# Altium schematic sheet Sheet1.SchDoc
size A4
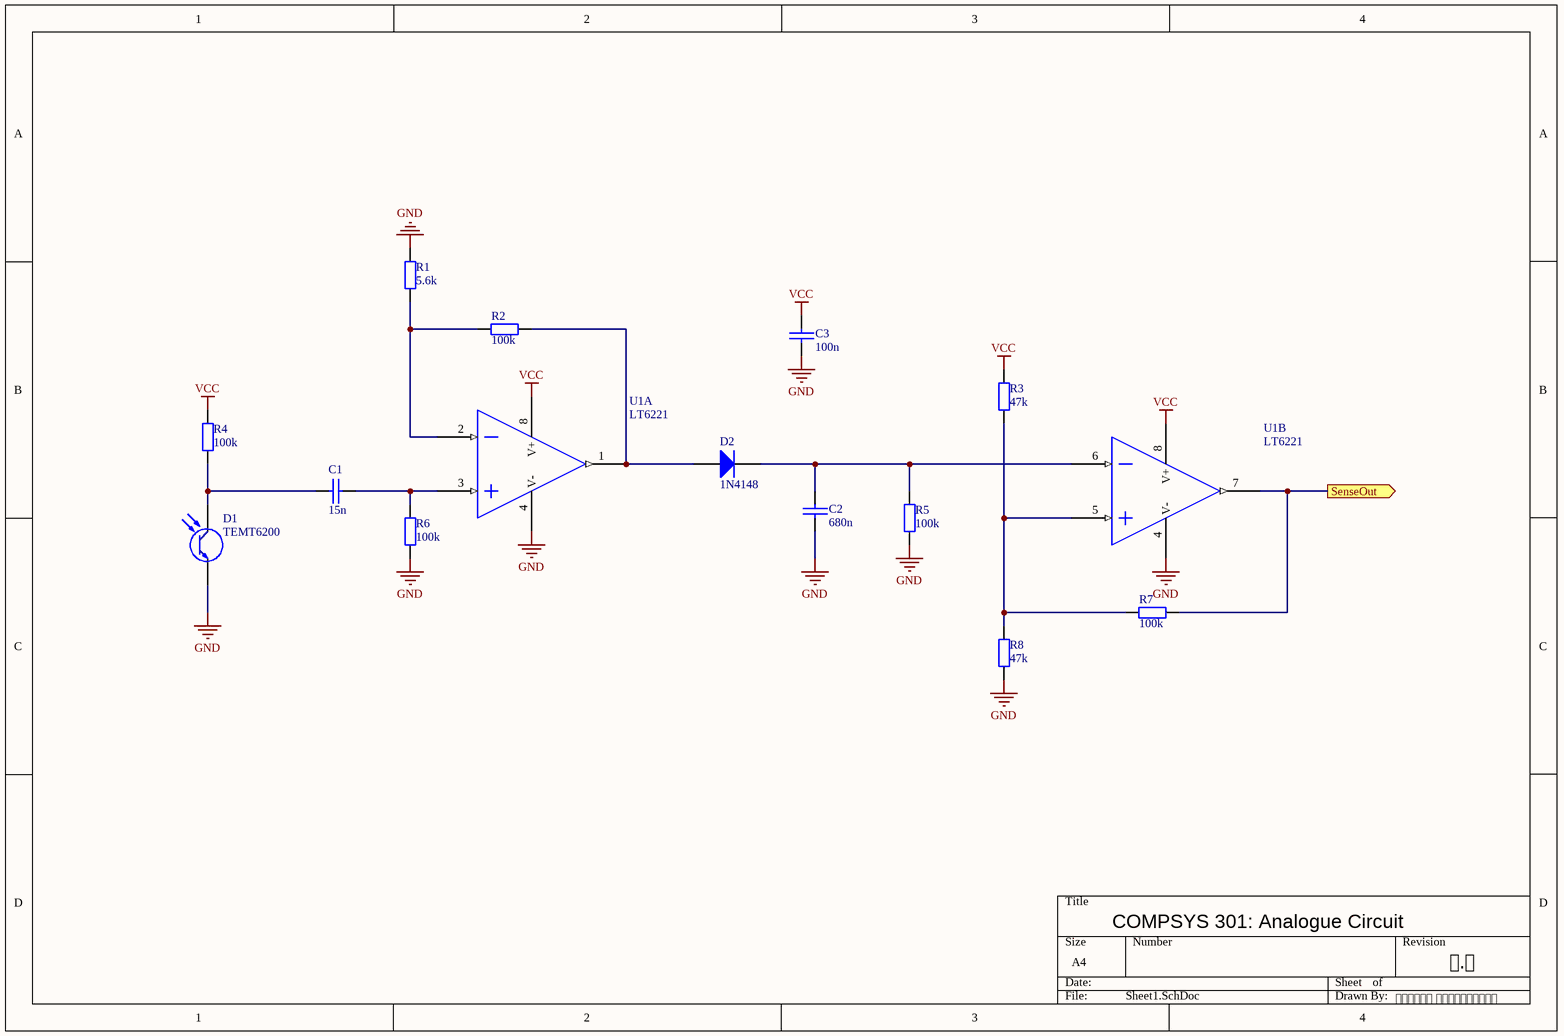
[diagram p0: Sheet1.SchDoc]

## Parts
C1  15n  [ECE-CAPC1608-0603SM]
C2  680n  [ECE-CAPC1608-0603SM]
C3  100n  [ECE-CAPC1608-0603SM]
D1  TEMT6200  [ECE-SENSOR-0805SM]
D2  1N4148  [ECE-DIO-SOD123SM]
R1  5.6k  [ECE-RESC1608-0603SM]
R2  100k  [ECE-RESC1608-0603SM]
R3  47k  [ECE-RESC1608-0603SM]
R4  100k  [ECE-RESC1608-0603SM]
R5  100k  [ECE-RESC1608-0603SM]
R6  100k  [ECE-RESC1608-0603SM]
R7  100k  [ECE-RESC1608-0603SM]
R8  47k  [ECE-RESC1608-0603SM]
U1  LT6221  [ECE-SO8]  (parts A,B of 2)

## Ports
SenseOut (out)

## Nets
GND: C2.1 C3.2 D1.1(E) R1.2 R5.1 R6.1 R8.1 U1.4(V-)
VCC: C3.1 R3.2 R4.2 U1.8(V+)
SenseOut: R7.1 U1.7(OUT2) ; port SenseOut
NetC1_1: C1.1 R6.2 U1.3(IN1(+))
NetC1_2: C1.2 D1.2(C) R4.1
NetC2_2: C2.2 D2.2(K) R5.2 U1.6(IN2(-))
NetD2_1: D2.1(A) R2.2 U1.1(OUT1)
NetR1_1: R1.1 R2.1 U1.2(IN1(-))
NetR3_1: R3.1 R7.2 R8.2 U1.5(IN2(+))

## Notes on the sheet
- COMPSYS 301: Analogue Circuit
- ௧.௦
- சகாயன் சிற்சபேசன்

## Library data of the parts
C1 = CAP000619: CAP CER 15nF 50V X7R SM0603; Value: 15n; UoA Stock#: CAP000619
C2 = CAP000629: CAP CER 680nF 25V X7R SM0603; Value: 680n; UoA Stock#: CAP000629
C3 = CAP000624: CAP CER 100nF 25V X7R SM0603; Value: 100n; UoA Stock#: CAP000624
D1 = OTH000001: LIGHT SENSOR TEMT6200 SM; Revision: July-2002: Re-released for DXP Platform.; UoA Stock#: OTH000001
D2 = DIO000103: DIODE GEN PURPOSE 300mA SM; Value: 1N4148; UoA Stock#: DIO000103
R1 = RES000147: RES CER 5K6 1608 SM; Value: 5.6k; UoA Stock#: RES000147
R2 R4-R7 = RES000162: RES CER 100K 1608 SM; Value: 100k; UoA Stock#: RES000162
R3 R8 = RES000158: RES CER 47K 1608 SM; Value: 47k; UoA Stock#: RES000158
U1 = OPA000102: IC OPAMP LT6221 DUAL SM; UoA Stock#: OPA000102